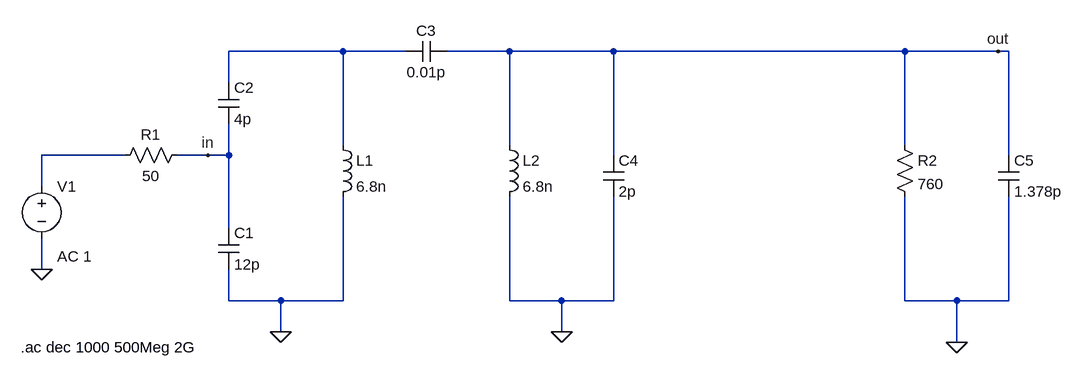
[diagram p0: schematic bandpass_ac.asc]
bandpass_ac.asc, the LTspice schematic file:
Version 4
SHEET 1 1708 680
WIRE 592 -48 416 -48
WIRE 688 -48 592 -48
WIRE 848 -48 752 -48
WIRE 1008 -48 848 -48
WIRE 1456 -48 1008 -48
WIRE 1600 -48 1456 -48
WIRE 1616 -48 1600 -48
WIRE 416 0 416 -48
WIRE 592 96 592 -48
WIRE 848 96 848 -48
WIRE 1456 96 1456 -48
WIRE 256 112 128 112
WIRE 384 112 336 112
WIRE 416 112 416 64
WIRE 416 112 384 112
WIRE 1008 112 1008 -48
WIRE 1616 112 1616 -48
WIRE 128 160 128 112
WIRE 416 224 416 112
WIRE 128 288 128 240
WIRE 416 336 416 288
WIRE 496 336 416 336
WIRE 592 336 592 176
WIRE 592 336 496 336
WIRE 848 336 848 176
WIRE 928 336 848 336
WIRE 1008 336 1008 176
WIRE 1008 336 928 336
WIRE 1456 336 1456 176
WIRE 1536 336 1456 336
WIRE 1616 336 1616 176
WIRE 1616 336 1536 336
WIRE 496 384 496 336
WIRE 928 384 928 336
WIRE 1536 400 1536 336
FLAG 128 288 0
FLAG 496 384 0
FLAG 928 384 0
FLAG 384 112 in
FLAG 1536 400 0
FLAG 1600 -48 out
SYMBOL voltage 128 144 R0
WINDOW 123 24 124 Left 2
WINDOW 39 0 0 Left 0
SYMATTR Value2 AC 1
SYMATTR InstName V1
SYMATTR Value ""
SYMBOL res 240 128 R270
WINDOW 0 32 56 VTop 2
WINDOW 3 0 56 VBottom 2
SYMATTR InstName R1
SYMATTR Value 50
SYMBOL cap 400 224 R0
SYMATTR InstName C1
SYMATTR Value 12p
SYMBOL cap 400 0 R0
SYMATTR InstName C2
SYMATTR Value 4p
SYMBOL ind 576 80 R0
SYMATTR InstName L1
SYMATTR Value 6.8n
SYMBOL cap 752 -64 R90
WINDOW 0 0 32 VBottom 2
WINDOW 3 32 32 VTop 2
SYMATTR InstName C3
SYMATTR Value 0.01p
SYMBOL ind 832 80 R0
SYMATTR InstName L2
SYMATTR Value 6.8n
SYMBOL cap 992 112 R0
SYMATTR InstName C4
SYMATTR Value 2p
SYMBOL res 1440 80 R0
SYMATTR InstName R2
SYMATTR Value 760
SYMBOL cap 1600 112 R0
SYMATTR InstName C5
SYMATTR Value 1.378p
TEXT 96 408 Left 2 !.ac dec 1000 500Meg 2G

The netlist it stands for:
* bandpass_ac.asc
V1 N002 0 AC 1
R1 N002 in 50
C1 in 0 12p
C2 N001 in 4p
L1 N001 0 6.8n
C3 out N001 0.01p
L2 out 0 6.8n
C4 out 0 2p
R2 out 0 760
C5 out 0 1.378p
.ac dec 1000 500Meg 2G
.backanno
.end

* Results of the author's LTspice run, read from the files saved beside the schematic
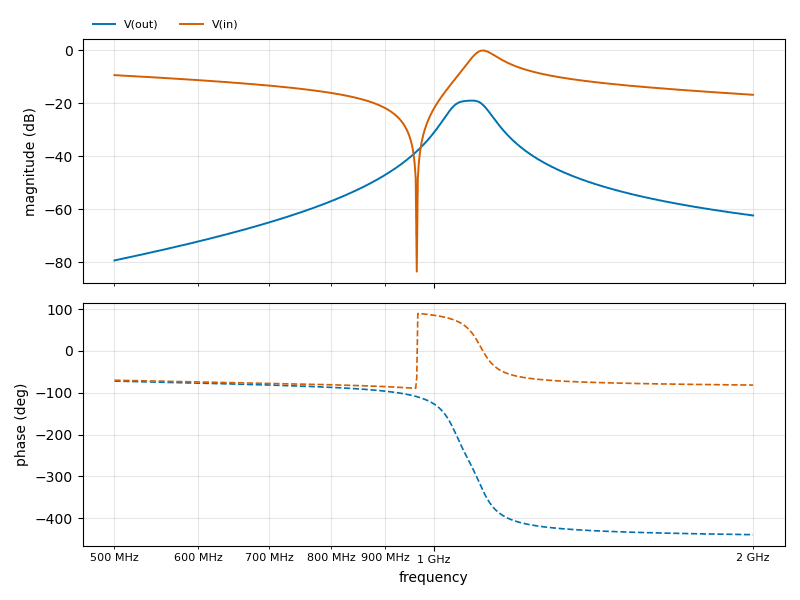
[diagram p1: AC Analysis of bandpass_ac.asc, plotted from the saved traces]
* AC Analysis, 1 run:
*   V(out): -79.24 dB at 500 MHz, -62.27 dB at 2 GHz, peak -18.92 dB at 1.086 GHz, 3 dB below the peak at 1.039 GHz and 1.121 GHz
*   V(in): -9.31 dB at 500 MHz, -16.73 dB at 2 GHz, peak -0.01 dB at 1.112 GHz, 3 dB below the peak at 1.085 GHz and 1.153 GHz